# EAGLE design POV3 (EAGLE 6.1)
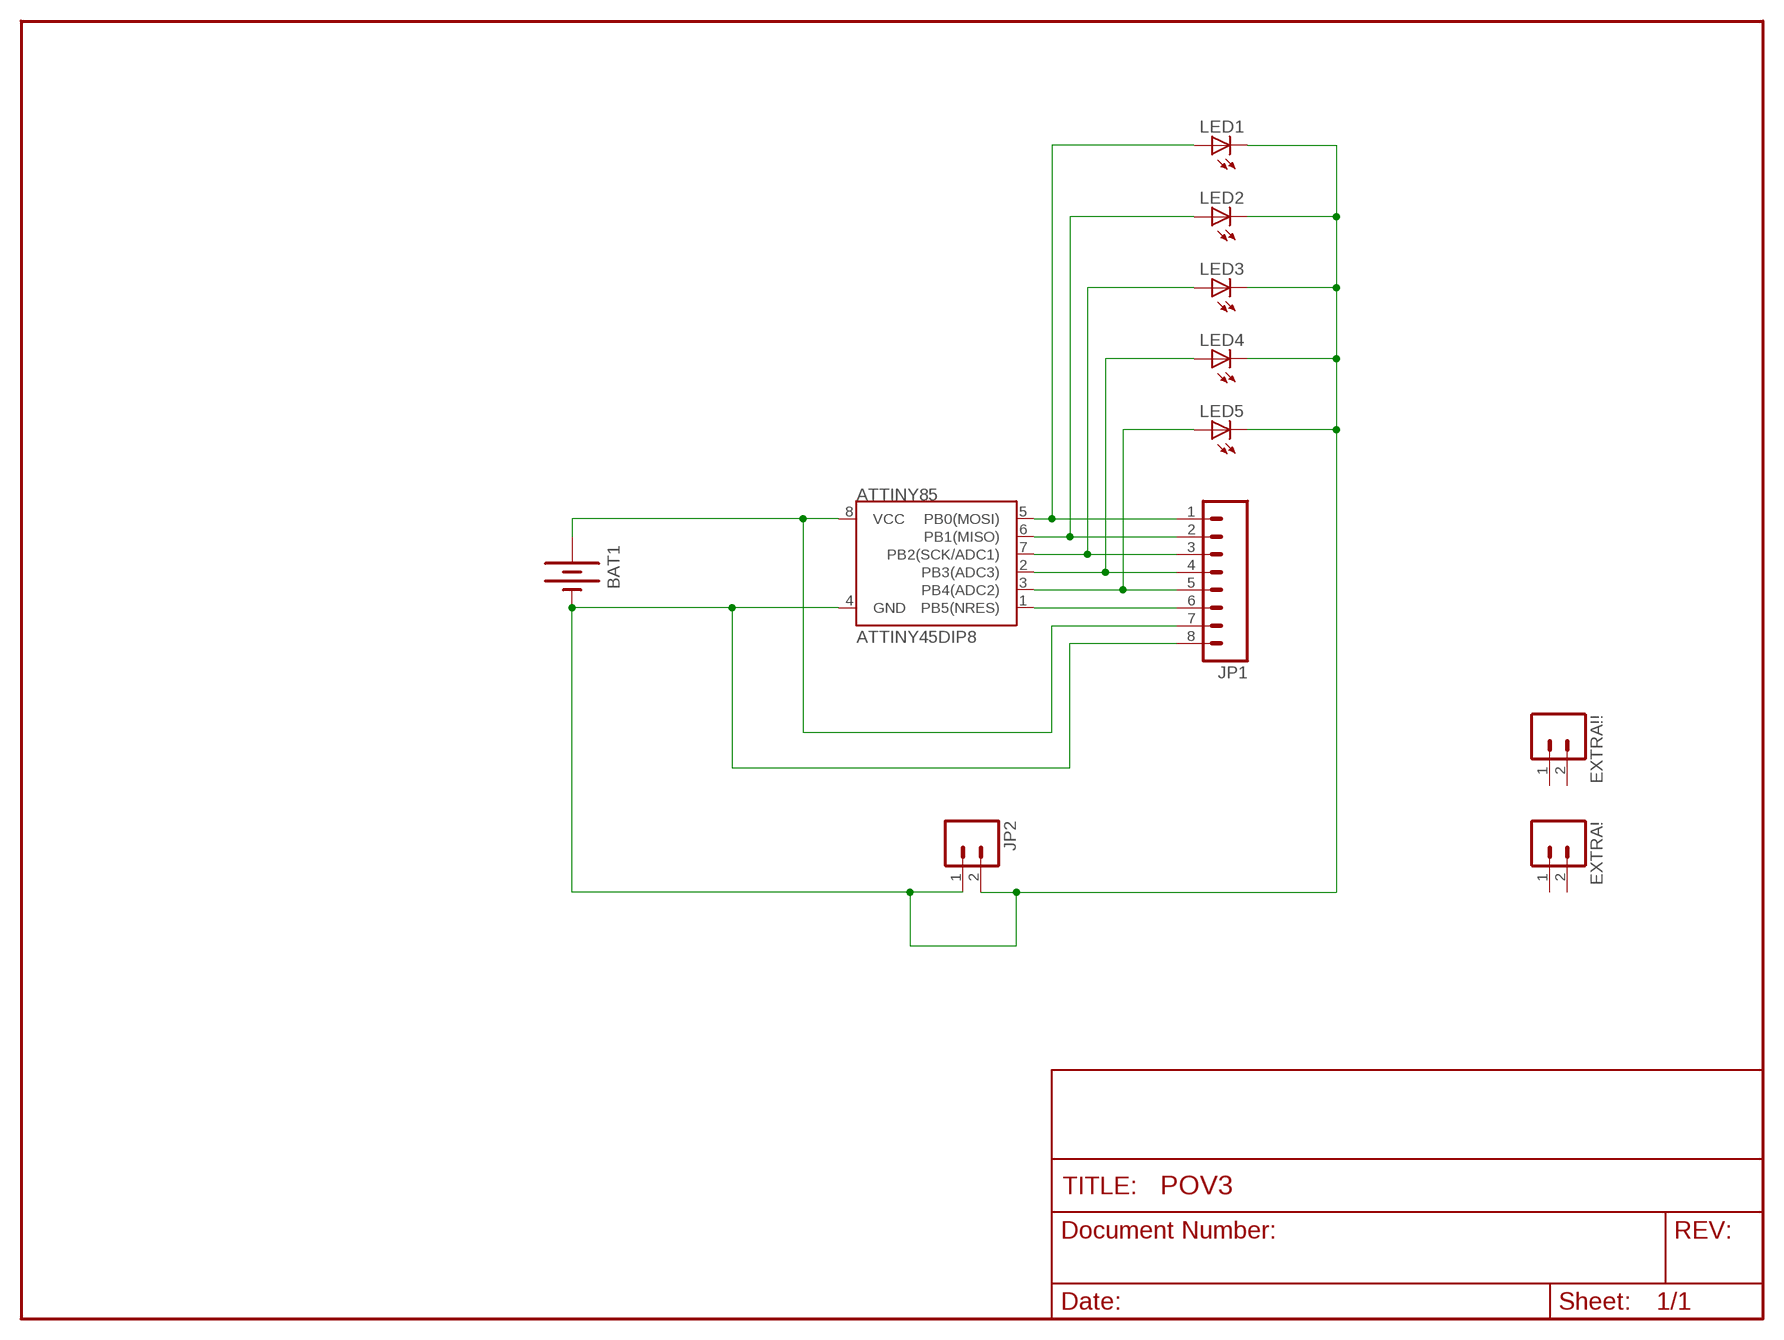
[diagram p0: schematic, sheet 1]

## Parts
ATTINY85  ATTINY45DIP8  [DIP08]
BAT1  BATTERY20PTH  [BATTCOM_20MM_PTH]
EXTRA!  M02PTH  [1X02]
EXTRA!!  M02PTH  [1X02]
JP1  M08  [1X08]
JP2  M02PTH  [1X02]
LED1  LED5MM  [LED5MM]
LED2  LED5MM  [LED5MM]
LED3  LED5MM  [LED5MM]
LED4  LED5MM  [LED5MM]
LED5  LED5MM  [LED5MM]

## Nets
N$1: ATTINY85.8(VCC) BAT1.1(+) JP1.7
N$3: ATTINY85.5(PB0(MOSI)) JP1.1 LED1.A
N$4: ATTINY85.6(PB1(MISO)) JP1.2 LED2.A
N$5: ATTINY85.7(PB2(SCK/ADC1)) JP1.3 LED3.A
N$6: ATTINY85.2(PB3(ADC3)) JP1.4 LED4.A
N$7: ATTINY85.3(PB4(ADC2)) JP1.5 LED5.A
N$8: ATTINY85.1(PB5(NRES)) JP1.6
N$9: ATTINY85.4(GND) BAT1.2(-) JP1.8 JP2.1 JP2.2 LED1.K(C) LED2.K(C) LED3.K(C) LED4.K(C) LED5.K(C)
Unconnected: EXTRA!!.1 EXTRA!!.2 EXTRA!.1 EXTRA!.2

## Library data of the parts
ATTINY85 = SparkFun:ATTINY45: Atmel ATTiny45
BAT1 = SparkFun:BATTERY: Battery Holders Various common sizes : AA, AAA, 20mm coin cell and 12mm coin cell.
EXTRA! EXTRA!! JP2 = SparkFun:M02: Header 2 Standard 2-pin 0.1" header. Use with straight break away headers (SKU : PRT-00116), right angle break away headers (PRT-00553), swiss pins (PRT-00743), machine pins (PRT-00117), and female headers (PRT-00115). Molex polarized connector foot print use with SKU : PRT-08233 with associated crimp pins and housings.
JP1 = SparkFun:M08: Header 8 Standard 8-pin 0.1" header. Use with straight break away headers (SKU : PRT-00116), right angle break away headers (PRT-00553), swiss pins (PRT-00743), machine pins (PRT-00117), and female headers (PRT-00115).
LED1-LED5 = SparkFun:LED: LEDs Standard schematic elements and footprints for 5mm, 3mm, 1206, and 0603 sized LEDs. 5mm - Spark Fun Electronics SKU : COM-00529 (and others)

## Board
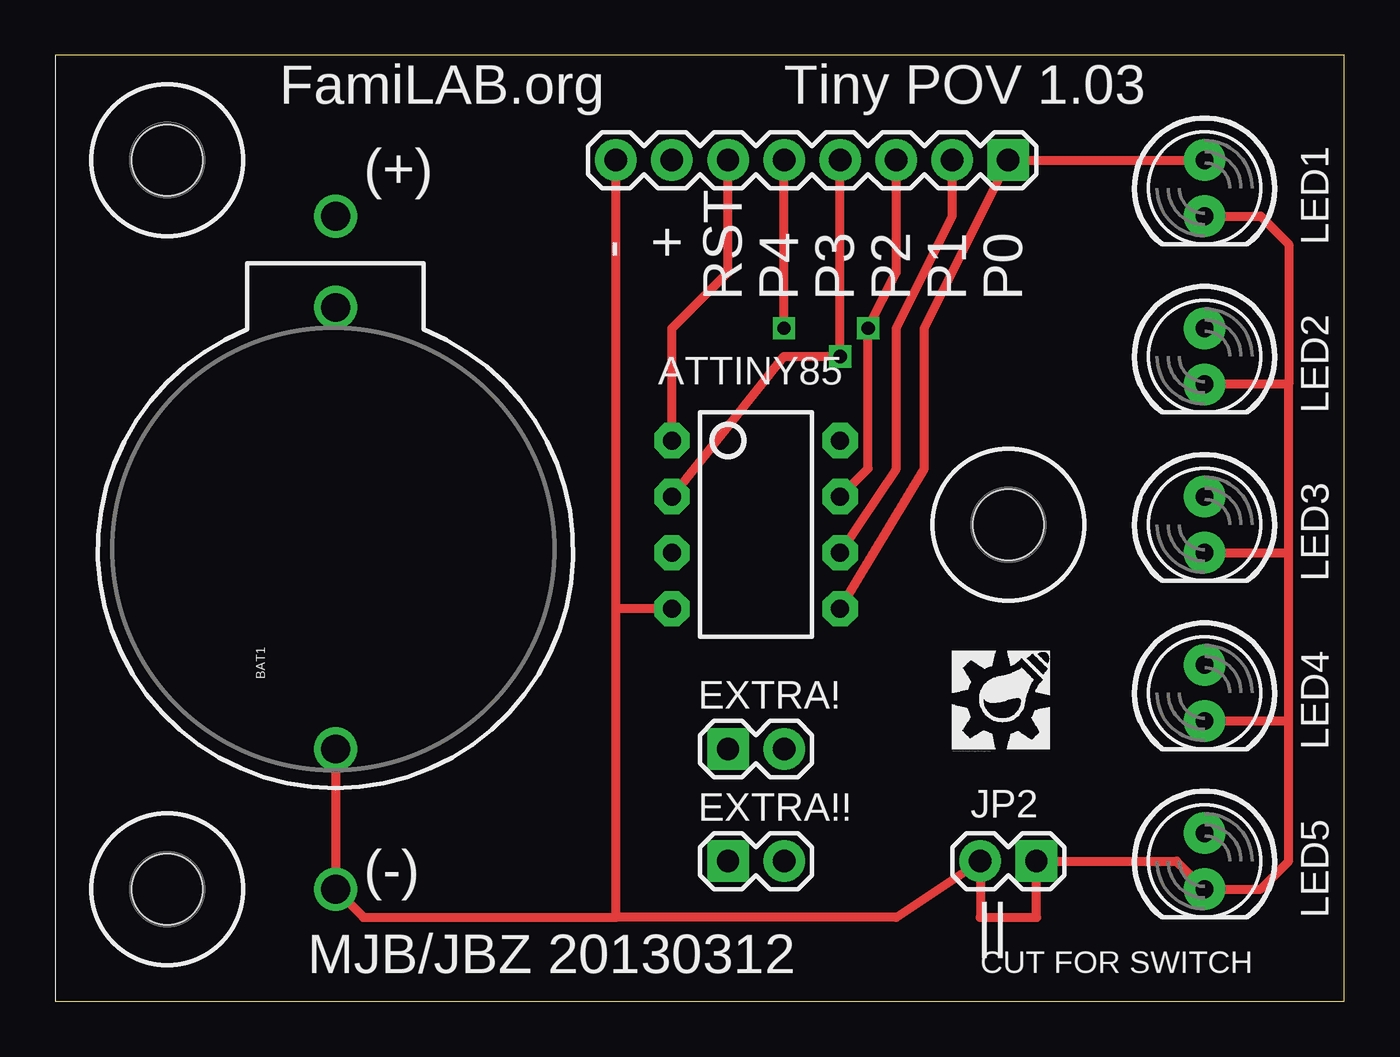
[diagram p1: board, top side]
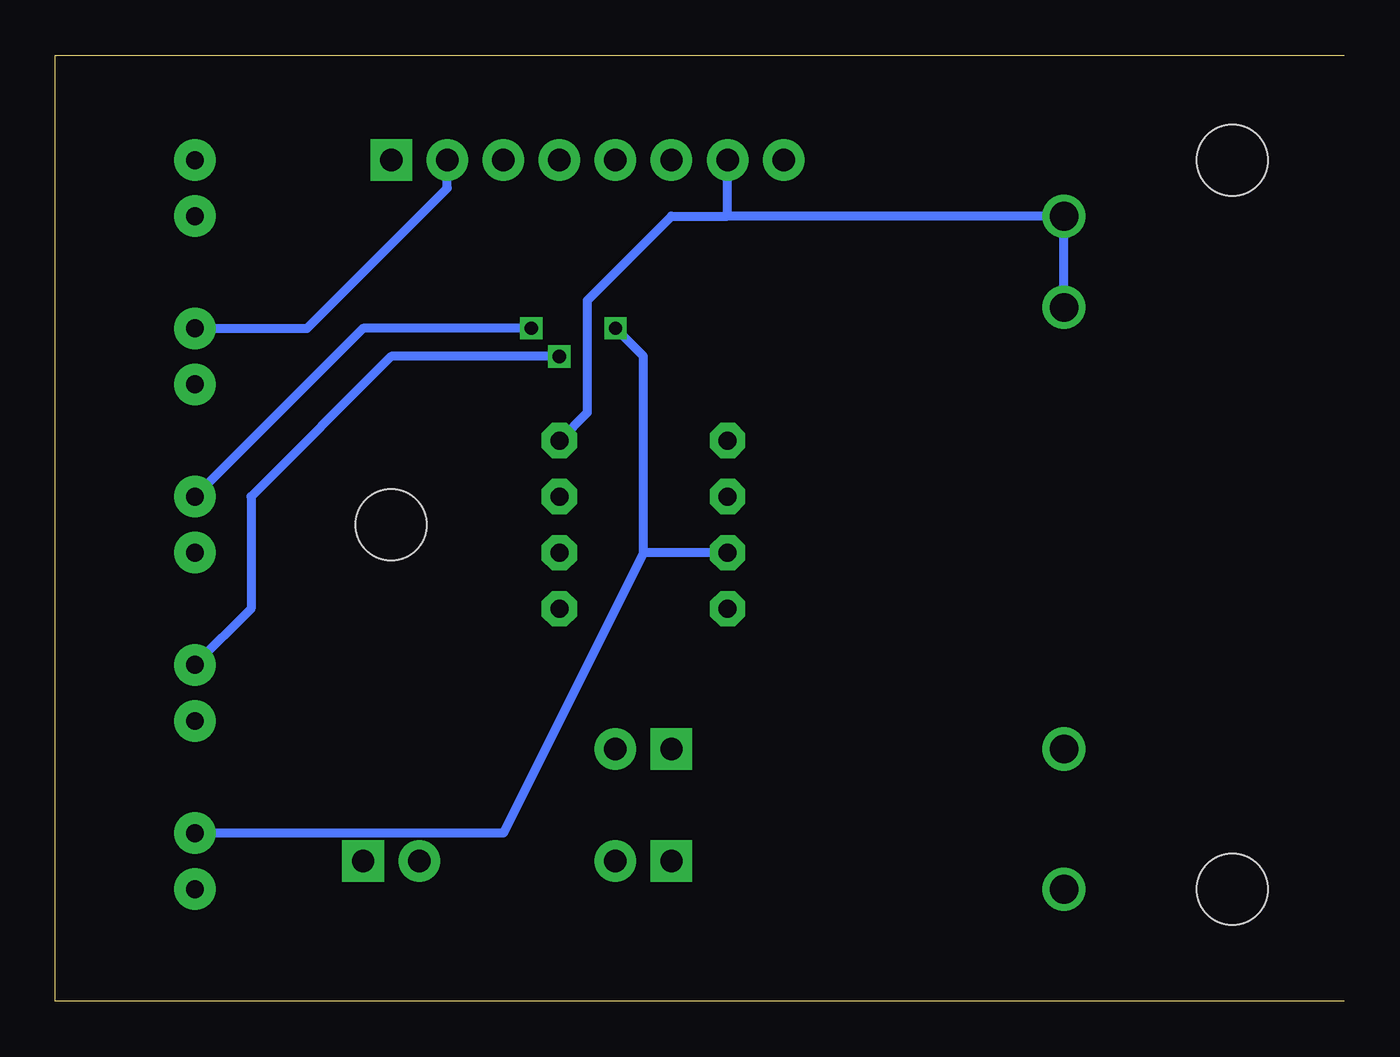
[diagram p2: board, bottom side, seen from below]

Size 58.4 x 42.85 mm. Coordinates in mm from the lower left corner, seen from the top.
Outline: 0,0 58.4,0 58.4,42.85 0,42.85
Copper layers (1*16): Top 0.035mm / dielectric 1.5mm / Bottom 0.035mm
Design rules: minimum track width 10mil, minimum drill 24mil, track to track 8mil, track to pad 8mil, pad to pad 8mil, via to via 8mil, smd to smd 8mil, copper to edge 40mil, drill to drill 8mil, minimum pad ring 10mil, minimum via ring 8mil, stop-mask expansion 4mil, vias tented up to drill 0mil, thermal gap 10mil

### Footprints (pad centres in the part's own frame; a part is rotated, then mirrored left to right if it is on the bottom)
DIP08 = drill 0.813 pad 1.6 octagon: 1 -3.81,-3.81; 2 -1.27,-3.81; 3 1.27,-3.81; 4 3.81,-3.81; 5 3.81,3.81; 6 1.27,3.81; 7 -1.27,3.81; 8 -3.81,3.81
BATTCOM_20MM_PTH = drill 1.3: 1 20,0; 2 0,0
1X02 = drill 1.016 pad 1.88 square: 1 0,0 | drill 1.016 pad 1.88: 2 2.54,0
1X08 = drill 1.016 pad 1.88 square: 1 0,0 | drill 1.016 pad 1.88: 2 2.54,0; 3 5.08,0; 4 7.62,0; 5 10.16,0; 6 12.7,0; 7 15.24,0; 8 17.78,0
LED5MM = drill 0.813 pad 1.88: A -1.27,0; K 1.27,0
3,2 = hole 3.2: 0,0

### Placement (x,y rotation side)
ATTINY85  31.75,21.59 270 top
BAT1  12.7,11.43 90 top
EXTRA!  30.48,11.43 0 top
EXTRA!!  30.48,6.35 0 top
JP1  43.18,38.1 180 top
JP2  44.45,6.35 180 top
LED1  52.07,36.83 270 top
LED2  52.07,29.21 270 top
LED3  52.07,21.59 270 top
LED4  52.07,13.97 270 top
LED5  52.07,6.35 270 top
U$1  [FAMILAB]  40.64,11.43 0 top
U$2  [3,2]  5.08,5.08 0 top
U$3  [3,2]  5.08,38.1 0 top
U$4  [3,2]  43.18,21.59 0 top

### Tracks (layer width: path | path; a pad name or v marks a point on that pad's centre or on a via)
N$1
  Bottom 0.406: BAT1.1 12.7,35.56 27.94,35.56 | 27.94,35.56 JP1.7 | ATTINY85.8 34.29,26.67 34.29,31.75 30.48,35.56 27.94,35.56
N$3
  Top 0.406: ATTINY85.5 39.37,24.13 39.37,30.48 JP1.1 LED1.A
N$4
  Top 0.406: ATTINY85.6 38.1,24.13 38.1,30.48 40.64,35.56 JP1.2
  Bottom 0.406: LED2.A 46.99,30.48 40.64,36.83 JP1.2
N$5  (via drill 0.6)
  Top 0.406: JP1.3 38.1,33.02 v36.83,30.48 36.83,24.13 ATTINY85.7
  Bottom 0.406: v36.83,30.48 44.45,30.48 LED3.A
N$6  (via drill 0.6)
  Top 0.406: JP1.4 v35.56,29.21 33.02,29.21 ATTINY85.2
  Bottom 0.406: v35.56,29.21 43.18,29.21 49.53,22.86 49.53,17.78 LED4.A
N$7  (via drill 0.6)
  Top 0.406: v33.02,30.48 JP1.5
  Bottom 0.406: 31.75,20.32 31.75,29.21 v33.02,30.48 | ATTINY85.3 31.75,20.32 | 31.75,20.32 38.1,7.62 LED5.A
N$8
  Top 0.406: ATTINY85.1 27.94,30.48 30.48,33.02 JP1.6
N$9  (via drill 1.3)
  Top 0.406: ATTINY85.4 25.4,17.78 | 25.4,17.78 JP1.8 | LED1.K 54.61,35.56 55.88,34.29 55.88,27.94 | 55.88,27.94 LED2.K | LED3.K 55.88,20.32 | 55.88,20.32 55.88,27.94 | LED4.K 55.88,12.7 | 55.88,12.7 55.88,20.32 | 55.88,12.7 55.88,6.35 54.61,5.08 LED5.K 50.8,6.35 JP2.1 44.45,3.81 41.91,3.81 JP2.2 38.1,3.81 25.4,3.81 | 25.4,3.81 25.4,17.78 | BAT1.2 v12.7,5.08 13.97,3.81 25.4,3.81
  other vias: 12.7,35.56

### Text on the board
_tsilk: FamiLAB.org | Tiny POV 1.03 | (+) | - | + | RST | P4 | P3 | P2 | P1 | P0 | (-) | || | MJB/JBZ 20130312 | CUT FOR SWITCH